# EAGLE schematic sterownik (EAGLE 6.6.0)
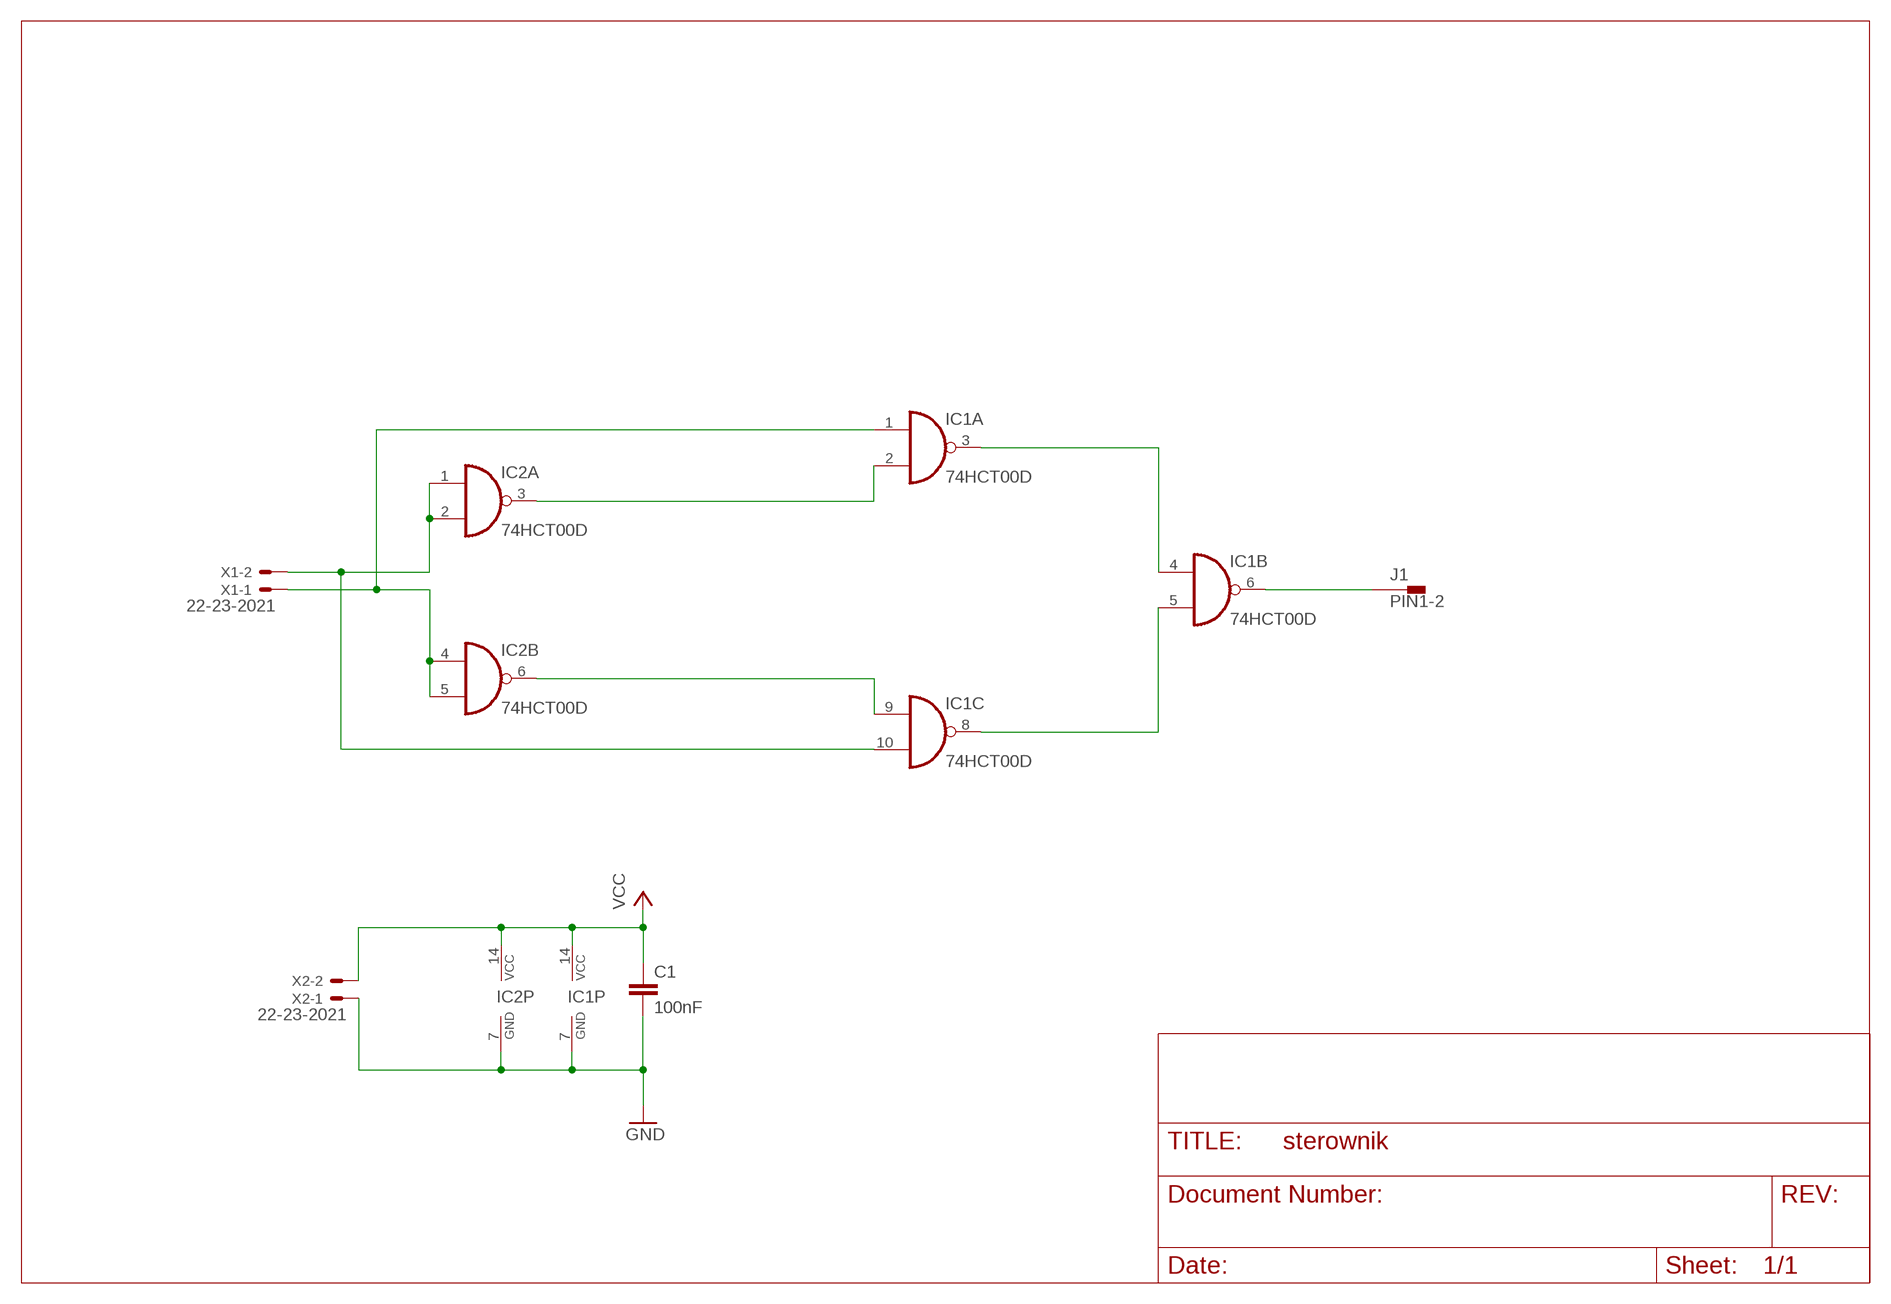
[diagram p0: schematic, sheet 1]

## Parts
C1  100nF  C-EU025-024X044  [C025-024X044]
IC1  74HCT00D  [SO14]
IC2  74HCT00D  [SO14]
J1  PIN1-2  [62221]
X1  22-23-2021  [22-23-2021]
X2  22-23-2021  [22-23-2021]

## Nets
GND: C1.2 IC1.7(P:GND) IC2.7(P:GND) X2.1
N$3: IC1.10(C:I1) IC2.1(A:I0) IC2.2(A:I1) X1.2
N$4: IC1.1(A:I0) IC2.4(B:I0) IC2.5(B:I1) X1.1
N$5: IC1.2(A:I1) IC2.3(A:O)
N$6: IC1.9(C:I0) IC2.6(B:O)
N$7: IC1.3(A:O) IC1.4(B:I0)
N$8: IC1.5(B:I1) IC1.8(C:O)
N$9: IC1.6(B:O) J1.1
VCC: C1.1 IC1.14(P:VCC) IC2.14(P:VCC) X2.2
Unconnected: IC1.11(D:O) IC1.12(D:I0) IC1.13(D:I1) IC2.8(C:O) IC2.9(C:I0) IC2.10(C:I1) IC2.11(D:O) IC2.12(D:I0) IC2.13(D:I1)

## Library data of the parts
C1 = resistor:C-EU: CAPACITOR, European symbol
IC1 IC2 = 74xx-eu:74*00: Quad 2-input NAND gate
J1 = con-faston:PIN1-2: CONN TAB FASTON BRASS .187 PCB TAB, FSSTON, DUAL STAKE, .187 SERIES Digi-Key Part Number: A24734CT-ND Source: Tyco Electronics Corporation .. ENG_CD_62221_R.pdf http://search.digikey.com/scripts/DkSearch/dksus.dll?Detail&name=A24734CT-ND; MF: TYCO ELECTRONICS; MPN: 62221-1; OC_FARNELL: unknown; OC_NEWARK: 16H2318
X1 X2 = con-molex:22-23-2021: .100" (2.54mm) Center Header - 2 Pin; MF: MOLEX; MPN: 22-23-2021; OC_FARNELL: 1462926; OC_NEWARK: 25C3832